# Altium schematic sheet Power adapter.SchDoc
size A4; SheetNumber: 3; SheetTotal: 7
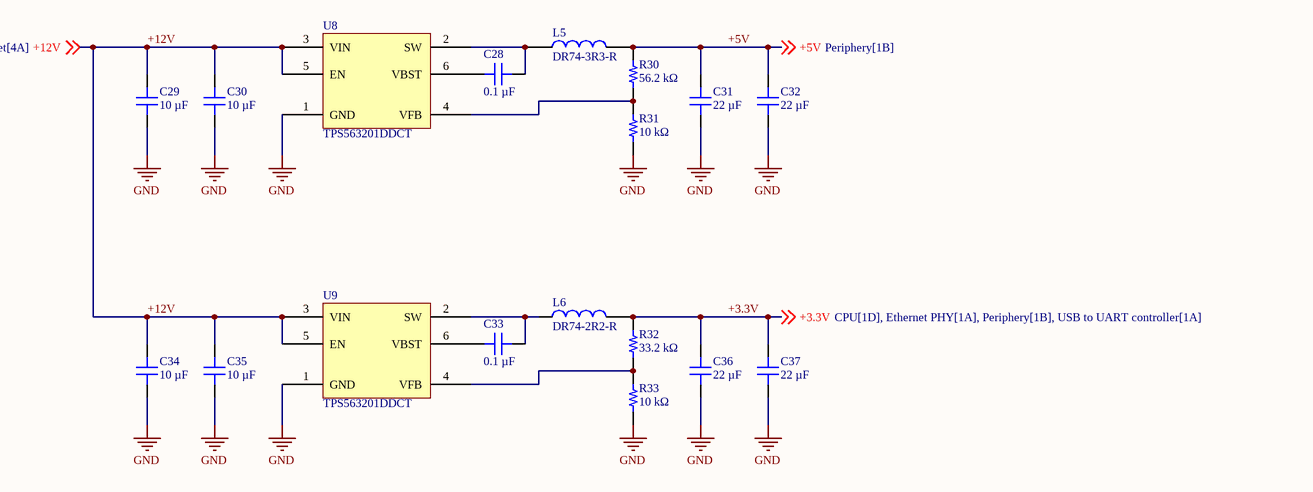
[diagram p0: Power adapter.SchDoc]

## Parts
C28  0.1 µF  [CAP 0603_1608]
C29  10 µF  [CAP 0805_2012]
C30  10 µF  [CAP 0805_2012]
C31  22 µF  [CAP 1206_3216 - 0.8MM]
C32  22 µF  [CAP 1206_3216 - 0.8MM]
C33  0.1 µF  [CAP 0603_1608]
C34  10 µF  [CAP 0805_2012]
C35  10 µF  [CAP 0805_2012]
C36  22 µF  [CAP 1206_3216 - 0.8MM]
C37  22 µF  [CAP 1206_3216 - 0.8MM]
L5  DR74-3R3-R  [INDPM7676X435N]
L6  DR74-2R2-R  [INDPM7676X435N]
R30  56.2 kΩ  [RES 0603_1608]
R31  10 kΩ  [RES 0603_1608]
R32  33.2 kΩ  [RES 0603_1608]
R33  10 kΩ  [RES 0603_1608]
U8  TPS563201DDCT  [TI SOT-23-6 DDC]
U9  TPS563201DDCT  [TI SOT-23-6 DDC]

## Nets
GND: C29.1 C30.1 C31.1 C32.1 C34.1 C35.1 C36.1 C37.1 R31.1 R33.1 U8.1(GND) U9.1(GND)
+3.3V: C36.2 C37.2 L6.2 R32.2 ; off-sheet +3.3V
+5V: C31.2 C32.2 L5.2 R30.2 ; off-sheet +5V
+12V: C29.2 C30.2 C34.2 C35.2 U8.3(VIN) U8.5(EN) U9.3(VIN) U9.5(EN) ; off-sheet +12V
NetC28_1: C28.1 L5.1 U8.2(SW)
NetC28_2: C28.2 U8.6(VBST)
NetC33_1: C33.1 L6.1 U9.2(SW)
NetC33_2: C33.2 U9.6(VBST)
NetR30_1: R30.1 R31.2 U8.4(VFB)
NetR32_1: R32.1 R33.2 U9.4(VFB)

## Library data of the parts
C28 C33 = C1608X7R1H104K080AE: CAP CER 0.1UF 50V X7R 0603; manufacturer: TDK Corporation; Tolerance: ±10%; Part Number: C1608X7R1H104K080AE; Capacitance: 0.1 µF; Applications: Boardflex Sensitive; componentlink1description: Datasheet; componentlink1url: https://product.tdk.com/info/en/catalog/datasheets/mlcc_commercial_soft_en.pdf?ref_disty=digikey; componentlink2description: DigiKey Link; componentlink2url: https://www.digikey.com/en/products/detail/tdk-corporation/C1608X7R1H104K080AE/4490564; Device Package: 0603 (1608 Metric); Features: Soft Termination; lastupdated: 9.02.2024 20:10:17; Lifecycle Status: Active; Minimum Order: 1; Mounting Type: Surface Mount, MLCC; Operating Temperature: -55°C ~ 125°C; Package / Case: 0603 (1608 Metric); packaging: TapeAndReel; partid: 12789; Part Status: Active; price: 0.02; series: C; Size / Dimension: 0.063" L x 0.031" W (1.60mm x 0.80mm); Supplier 1: DigiKey; Supplier Part Number 1: 445-15927-6-ND; Temperature Coefficient: X7R; Thickness (Max): 0.037" (0.95mm); value: 0.1 µF; Voltage - Rated: 50V
C29 C30 C34 C35 = CL21B106KOQNNNE: CAP CER 10UF 16V X7R 0805; manufacturer: Samsung Electro-Mechanics; Tolerance: ±10%; Part Number: CL21B106KOQNNNE; Capacitance: 10 µF; Applications: General Purpose; componentlink1description: Datasheet; componentlink1url: http://www.samsungsem.com/kr/support/product-search/mlcc/CL21B106KOQNNNE.jsp; componentlink2description: DigiKey Link; componentlink2url: https://www.digikey.com/en/products/detail/samsung-electro-mechanics/CL21B106KOQNNNE/3888530; Device Package: 0805 (2012 Metric); lastupdated: 9.02.2024 20:15:41; Lifecycle Status: Active; Minimum Order: 1; Mounting Type: Surface Mount, MLCC; Operating Temperature: -55°C ~ 125°C; Package / Case: 0805 (2012 Metric); packaging: TapeAndReel; partid: 40933; Part Status: Active; price: 0.03; series: CL; Size / Dimension: 0.079" L x 0.049" W (2.00mm x 1.25mm); Temperature Coefficient: X7R; Thickness (Max): 0.055" (1.40mm); value: 10 µF; Voltage - Rated: 16V; Supplier 1: DigiKey; Supplier Part Number 1: 1276-2872-1-ND; Supplier 2: TME; Supplier Part Number 2: CL21B106KOQNNNE
C31 C32 C36 C37 = CL31B226KPHNNNE: CAP CER 22UF 10V X7R 1206; manufacturer: Samsung Electro-Mechanics; Tolerance: ±10%; Part Number: CL31B226KPHNNNE; Capacitance: 22 µF; Applications: General Purpose; componentlink1description: Datasheet; componentlink1url: http://www.samsungsem.com/kr/support/product-search/mlcc/CL31B226KPHNNNE.jsp; componentlink2description: DigiKey Link; componentlink2url: https://www.digikey.com/en/products/detail/samsung-electro-mechanics/CL31B226KPHNNNE/3888427; Device Package: 1206 (3216 Metric); lastupdated: 4.06.2024 19:10:41; Lifecycle Status: Active; Minimum Order: 1; Mounting Type: Surface Mount, MLCC; Operating Temperature: -55°C ~ 125°C; Package / Case: 1206 (3216 Metric); packaging: TapeAndReel; partid: 19611; Part Status: Active; price: 0.08; series: CL; Size / Dimension: 0.126" L x 0.063" W (3.20mm x 1.60mm); Supplier 1: DigiKey; Supplier Part Number 1: 1276-2769-1-ND; Temperature Coefficient: X7R; Thickness (Max): 0.071" (1.80mm); value: 22 µF; Voltage - Rated: 10V
L5 = DR74-3R3-R: EATON COILTRONICS - DR74-3R3-R - Power Inductor (SMD), 3.3 H, 3.94 A, Shielded, 5.4 A, DR Series, 7.6mm x 7.6mm x 4.35mm; Manufacturer_Name: Eaton; Manufacturer_Part_Number: DR74-3R3-R; Mouser Part Number: 704-DR74-3R3-R; Mouser Price/Stock: https://www.mouser.co.uk/ProductDetail/Bussmann-Eaton/DR74-3R3-R?qs=yzwxPInThYRgV9ebcXY7Bg%3D%3D; Arrow Part Number: DR74-3R3-R; Arrow Price/Stock: https://www.arrow.com/en/products/dr74-3r3-r/eaton?region=nac; Datasheet Link: https://ms.componentsearchengine.com/Datasheets/2/DR74-3R3-R.pdf; Geometry.Height: 4.35mm; Supplier 1: TME; Supplier Part Number 1: DR74-3R3-R; Supplier 2: Farnell; Supplier Part Number 2: 4437558; Supplier 3: DigiKey; Supplier Part Number 3: 513-1665-6-ND
L6 = DR74-2R2-R: Fixed Inductors 2.2uH 7A 0.0126ohms; Manufacturer_Name: Eaton; Geometry.Height: 4.35mm; Manufacturer_Part_Number: DR74-2R2-R; Mouser Part Number: 704-DR74-2R2-R; Mouser Price/Stock: https://www.mouser.co.uk/ProductDetail/Eaton-Electronics/DR74-2R2-R?qs=yzwxPInThYTMNtV4%252BtE9KA%3D%3D; Arrow Part Number: DR74-2R2-R; Arrow Price/Stock: https://www.arrow.com/en/products/dr74-2r2-r/eaton; Datasheet Link: https://componentsearchengine.com/Datasheets/1/DR74-2R2-R.pdf; Supplier 1: TME; Supplier Part Number 1: DR74-2R2-R; Supplier 2: RS; Supplier Part Number 2: 7701163; Supplier 3: DigiKey; Supplier Part Number 3: 513-1140-6-ND
R30 = CRCW060356K2FKEA: RES SMD 56.2K OHM 1% 1/10W 0603; Manufacturer: Vishay Dale; Power (Watts): 0.1W, 1/10W; Resistance: 56.2 kOhms; Temperature Coefficient: ±100ppm/°C; Part Number: CRCW060356K2FKEA; Value: 56.2 kΩ; ComponentLink1Description: Datasheet; ComponentLink1URL: http://www.vishay.com/docs/20035/dcrcwe3.pdf; ComponentLink2Description: DigiKey Link; ComponentLink2URL: https://www.digikey.com/en/products/detail/vishay-dale/CRCW060356K2FKEA/1174868; Composition: Thick Film; Device Package: 0603 (1608 Metric); Features: Automotive AEC-Q200; Height - Seated (Max): 0.020" (0.50mm); LastUpdated: 9.02.2024 20:43:05; Lifecycle Status: Active; Minimum Order: 1; Number of Terminations: 2; Operating Temperature: -55°C ~ 155°C; Package / Case: 0603 (1608 Metric); Packaging: TapeAndReel; PartId: 12682; Part Status: Active; Price: 0.01; Ratings: AEC-Q200; Series: CRCW; Size / Dimension: 0.061" L x 0.033" W (1.55mm x 0.85mm); Supplier 1: DigiKey; Supplier Part Number 1: 541-56.2KHCT-ND; Supplier Device Package: 0603; Tolerance: ±1%
R31 R33 = CRCW060310K0FKEA: RES SMD 10K OHM 1% 1/10W 0603; Manufacturer: Vishay Dale; Power (Watts): 0.1W, 1/10W; Resistance: 10 kOhms; Temperature Coefficient: ±100ppm/°C; Part Number: CRCW060310K0FKEA; Value: 10 kΩ; ComponentLink1Description: Datasheet; ComponentLink1URL: http://www.vishay.com/docs/20035/dcrcwe3.pdf; ComponentLink2Description: DigiKey Link; ComponentLink2URL: https://www.digikey.com/en/products/detail/vishay-dale/CRCW060310K0FKEA/1174782; Composition: Thick Film; Device Package: 0603 (1608 Metric); Features: Automotive AEC-Q200; Height - Seated (Max): 0.020" (0.50mm); LastUpdated: 9.02.2024 20:42:10; Lifecycle Status: Active; Minimum Order: 1; Number of Terminations: 2; Operating Temperature: -55°C ~ 155°C; Package / Case: 0603 (1608 Metric); Packaging: CutTape; PartId: 24636; Part Status: Active; Price: 0.01; Ratings: AEC-Q200; Series: CRCW; Size / Dimension: 0.061" L x 0.033" W (1.55mm x 0.85mm); Supplier 1: DigiKey; Supplier Part Number 1: 541-10.0KHCT-ND; Supplier Device Package: 0603; Tolerance: ±1%
R32 = CRCW060333K2FKEA: RES SMD 33.2K OHM 1% 1/10W 0603; Manufacturer: Vishay Dale; Power (Watts): 0.1W, 1/10W; Resistance: 33.2 kOhms; Temperature Coefficient: ±100ppm/°C; Part Number: CRCW060333K2FKEA; Value: 33.2 kΩ; ComponentLink1Description: Datasheet; ComponentLink1URL: http://www.vishay.com/docs/20035/dcrcwe3.pdf; ComponentLink2Description: DigiKey Link; ComponentLink2URL: https://www.digikey.com/en/products/detail/vishay-dale/CRCW060333K2FKEA/1174840; Composition: Thick Film; Device Package: 0603 (1608 Metric); Features: Automotive AEC-Q200; Height - Seated (Max): 0.020" (0.50mm); LastUpdated: 9.02.2024 20:43:05; Lifecycle Status: Active; Minimum Order: 1; Number of Terminations: 2; Operating Temperature: -55°C ~ 155°C; Package / Case: 0603 (1608 Metric); Packaging: TapeAndReel; PartId: 12807; Part Status: Active; Price: 0.01; Ratings: AEC-Q200; Series: CRCW; Size / Dimension: 0.061" L x 0.033" W (1.55mm x 0.85mm); Supplier 1: DigiKey; Supplier Part Number 1: 541-33.2KHCT-ND; Supplier Device Package: 0603; Tolerance: ±1%
U8 U9 = TPS563201DDCT: IC REG BUCK ADJ 3A TSOT23-6; Manufacturer: Texas Instruments; Frequency - Switching: 580kHz; Function: Step-Down; Number of Outputs: 1; Output Configuration: Positive; Output Type: Adjustable; Synchronous Rectifier: Yes; Voltage - Input (Max): 17V; Voltage - Input (Min): 4.5V; Voltage - Output (Max): 7V; Voltage - Output (Min/Fixed): 0.768V; Part Number: TPS563201DDCT; ComponentLink1Description: Datasheet; ComponentLink1URL: http://www.ti.com/general/docs/suppproductinfo.tsp?distId=10&gotoUrl=http%3A%2F%2Fwww.ti.com%2Flit%2Fgpn%2Ftps563201; ComponentLink2Description: DigiKey Link; ComponentLink2URL: //digikey.com/product-detail/en/texas-instruments/TPS563201DDCT/296-43393-2-ND/5813458; Current - Output: 3A; Device Package: SOT-23-6 Thin, TSOT-23-6; LastUpdated: 12.12.2019 10:07:22; Lifecycle Status: 0; Minimum Order: 1; Mounting Type: Surface Mount; Operating Temperature: -40°C ~ 125°C (TJ); Package / Case: SOT-23-6 Thin, TSOT-23-6; Packaging: TapeAndReel; Part Status: Active; Price: 0.54; Series: D-CAP2™, Eco-Mode™; Supplier 1: DigiKey; Supplier Part Number 1: 296-43393-2-ND; Supplier Device Package: TSOT-23-6; Topology: Buck